# Altium schematic sheet Eth-Crystal.SchDoc
size A
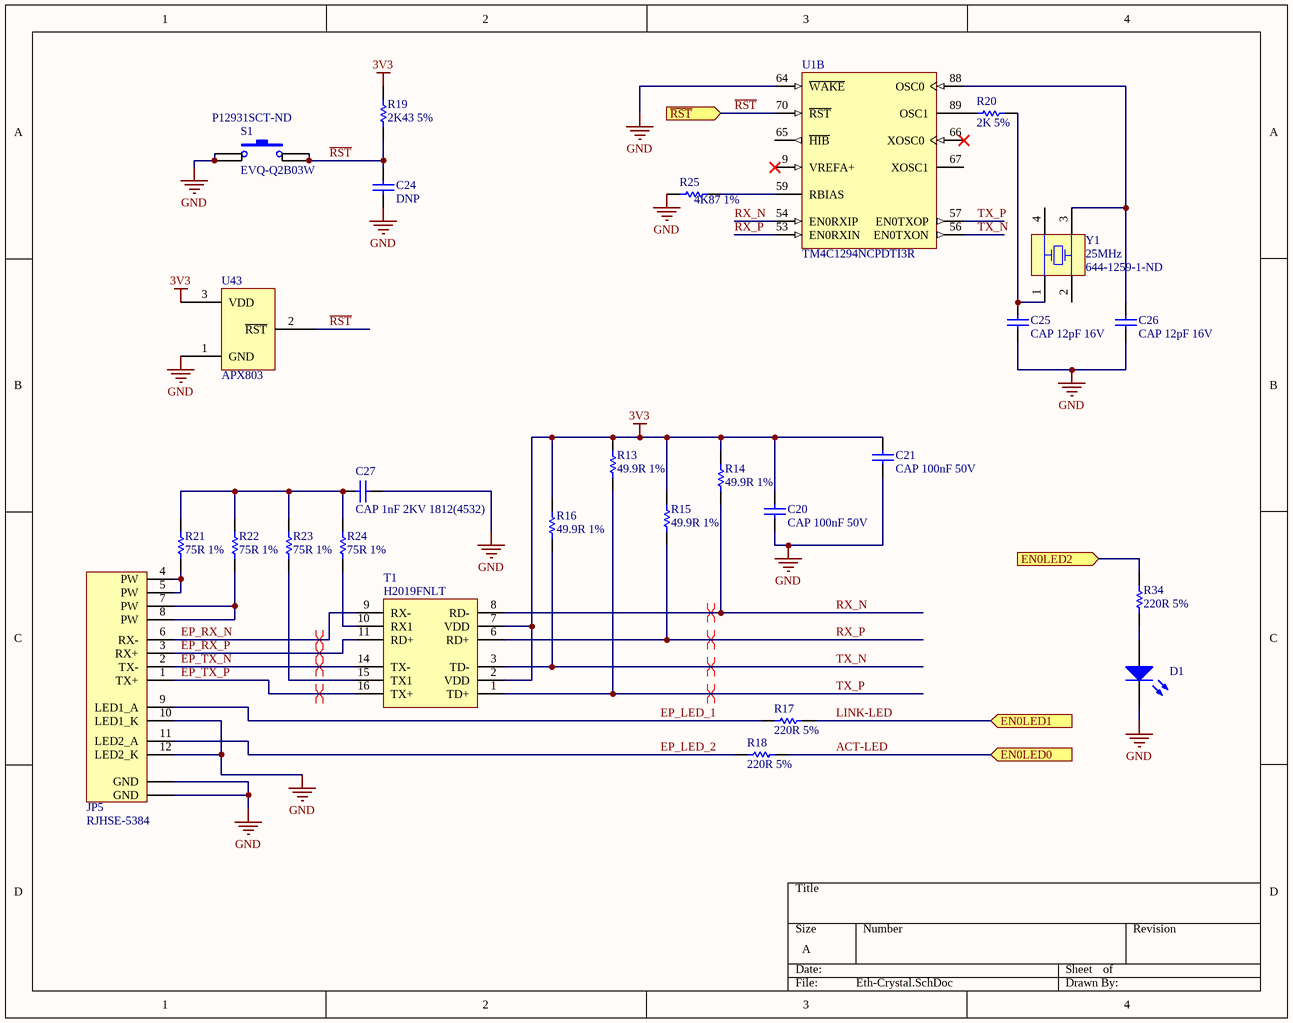
[diagram p0: Eth-Crystal.SchDoc]

## Parts
C20  CAP 100nF 50V  [CAPC0603(1608)100_M]
C21  CAP 100nF 50V  [CAPC0603(1608)100_M]
C24  DNP  [0603]
C25  CAP 12pF 16V  [CAPC0603(1608)100_L]
C26  CAP 12pF 16V  [CAPC0603(1608)100_L]
C27  CAP 1nF 2KV 1812(4532)  [CAPC1812(4532)230_N]
D1  LED  [LED-0603]  (value not drawn)
JP5  RJHSE-5384  [RJHSE-5484]
R13  49.9R 1%  [RESC0603(1608)_M]
R14  49.9R 1%  [RESC0603(1608)_M]
R15  49.9R 1%  [RESC0603(1608)_M]
R16  49.9R 1%  [RESC0603(1608)_M]
R17  220R 5%  [RESC0603(1608)_M]
R18  220R 5%  [RESC0603(1608)_M]
R19  2K43 5%  [RESC0603(1608)_M]
R20  2K 5%  [RESC0603(1608)_N]
R21  75R 1%  [RESC0603(1608)_N]
R22  75R 1%  [RESC0603(1608)_N]
R23  75R 1%  [RESC0603(1608)_N]
R24  75R 1%  [RESC0603(1608)_N]
R25  4K87 1%  [RESC0603(1608)_M]
R34  220R 5%  [RESC0603(1608)_M]
S1  EVQ-Q2B03W  Supplier Part Number 1: P12931SCT-ND  [TACTILE_SWITCH_SMD]
T1  H2019FNLT  [HXXXX]
U1  TM4C1294NCPDTI3R  [TI-PDT128_M]  (part B of 3)
U43  APX803  [SOT-23 - ESD]
Y1  Supplier Part Number 1: 644-1259-1-ND  [Crystal 3.2x2.5]  (hidden comment: 25MHz)

## Ports
EN0LED0 (in), EN0LED1 (in), EN0LED2 (in), ~{RST} (in)

## Nets
3V3: C20.2 C21.2 R13.2 R14.2 R15.2 R16.2 R19.2 T1.2(VDD) T1.7(VDD) U43.3(VDD)
GND: C20.1 C21.1 C24.1 C25.1 C26.1 C27.2 D1.2(K) JP5.10(LED1_K) JP5.12(LED2_K) JP5.GND1(GND) JP5.GND2(GND) R25.1 S1.1 S1.2 U1.64(~{WAKE}) U43.1(GND)
ACT-LED: R18.2 ; port EN0LED0
EN0LED2: R34.2 ; port EN0LED2
EP_LED_1: JP5.9(LED1_A) R17.1
EP_LED_2: JP5.11(LED2_A) R18.1
EP_RX_N: JP5.6(RX-) T1.9(RX-)
EP_RX_P: JP5.3(RX+) T1.11(RD+)
EP_TX_N: JP5.2(TX-) T1.14(TX-)
EP_TX_P: JP5.1(TX+) T1.16(TX+)
LINK-LED: R17.2 ; port EN0LED1
~{RST}: C24.2 R19.1 S1.3 S1.4 U1.70(~{RST}) U43.2(~{RST}) ; port ~{RST}
RX_N: R14.1 T1.8(RD-) U1.54(EN0RXIP)
RX_P: R15.1 T1.6(RD+) U1.53(EN0RXIN)
TX_N: R16.1 T1.3(TD-) U1.56(EN0TXON)
TX_P: R13.1 T1.1(TD+) U1.57(EN0TXOP)
NetC25_2: C25.2 R20.2 Y1.1(OSC1)
NetC26_2: C26.2 U1.88(OSC0) Y1.3(OSC2)
NetC27_1: C27.1 R21.2 R22.2 R23.2 R24.2
NetD1_1: D1.1(A) R34.1
NetJP5_4: JP5.4(PW) JP5.5(PW) R21.1
NetJP5_7: JP5.7(PW) JP5.8(PW) R22.1
NetR20_1: R20.1 U1.89(OSC1)
NetR23_1: R23.1 T1.15(TX1)
NetR24_1: R24.1 T1.10(RX1)
NetR25_2: R25.2 U1.59(RBIAS)

Not connected (* = marked no-connect by the designer): U1 9(VREFA+)* 65(~{HIB}) 66(XOSC0)* 67(XOSC1); Y1 2(OSC2) 4(OSC1)

## Layout directives
differential pair: EP_RX_N, EP_RX_P, EP_TX_N, EP_TX_P, RX_N, RX_P, TX_N, TX_P

## Library data of the parts
C20 C21 = CMP-1035-00010-1: CAP 100nF 50V Â±0.1pF 0603 (1608 Metric) Thickness 1mm SMD; Case-Metric: 1608; Case-EIA: 0603; Tolerance: Â±0.1pF; Technology: SMT; Value: 100nF; Max Thickness: 1 mm; Rated Voltage: 50 V
C24 = Cap_100pF: 100nF; Published: 8-Jun-2000; LatestRevisionDate: 29-May-2009; LatestRevisionNote: IPC-7351 Footprint Added.; PackageReference: C1206; Publisher: Altium Limited; PackageDescription: Chip Capacitor; Value: 100nF; Supplier 1: Digi-Key; Supplier Part Number 1: 399-1096-1-ND; Supplier 2: Mouser; Supplier Part Number 2: 80-C0603C104K3R
C25 C26 = CMP-1035-00602-1: CAP 12pF 16V Â±0.25pF 0603 (1608 Metric) Thickness 1mm SMD; Case-EIA: 0603; Case-Metric: 1608; Technology: SMT; Value: 12pF; Max Thickness: 1 mm; Rated Voltage: 16 V; Tolerance: Â±0.25pF
C27 = CMP-1040-00330-1: CAP 1nF 2KV Â±10% 1812 (4532 Metric) Thickness 2.3mm SMD; Case-EIA: 1812; Case-Metric: 4532; Technology: SMT; Tolerance: Â±10%; Value: 1nF; Max Thickness: 2.3 mm; Rated Voltage: 2K V
D1 = LED: Typical RED, GREEN, YELLOW, AMBER GaAs LED; Published: 8-Jun-2000; LatestRevisionDate: 17-Jul-2002; LatestRevisionNote: Re-released for DXP Platform.; PackageVersion: Feb-2002; PackageReference: 3.2X1.6X1.1; Publisher: Altium Limited; PackageDescription: SM LED; 2 Flat Leads; Supplier 1: Digi-Key; Supplier 2: Mouser; Supplier Part Number 1: 475-1409-1-ND; Supplier Part Number 2: 720-LGQ971-KN-1
JP5 = Ethernet Socket: Ethernet Socket RJ45 With Leds; Supplier 1: Digi-Key; Supplier 2: Mouser; Supplier Part Number 1: RJHSE-5384-ND; Supplier Part Number 2: 523-RJHSE-5484
R13-R16 = CMP-1012-00042-1: 49.9R 0.1W 1% 0603 (1608 Metric)  SMD; Tolerance: 5 %; Value: 49.90 Ohm; Case-Metric: 1608; Case-EIA: 0603; Technology: SMT; Power: 0.1 W
R17 R18 R34 = CMP-1012-00058-1: 220R 0.1W 5% 0603 (1608 Metric)  SMD; Case-EIA: 0603; Case-Metric: 1608; Value: 220.00 Ohm; Technology: SMT; Power: 0.1 W; Tolerance: 5 %
R19 = CMP-1012-00083-1: 2K43 0.1W 5% 0603 (1608 Metric)  SMD; Value: 2430.00 Ohm; Case-Metric: 1608; Case-EIA: 0603; Tolerance: 5 %; Technology: SMT; Power: 0.1 W
R20 = CMP-1012-00081-1: 2K 0.1W 5% 0603 (1608 Metric)  SMD; Case-Metric: 1608; Value: 2000.00 Ohm; Case-EIA: 0603; Tolerance: 5 %; Technology: SMT; Power: 0.1 W
R21-R24 = CMP-1012-00047-1: 75R 0.1W 1% 0603 (1608 Metric)  SMD; Case-EIA: 0603; Value: 75.00 Ohm; Case-Metric: 1608; Tolerance: 5 %; Technology: SMT; Power: 0.1 W
R25 = CMP-1012-00090-1: 4K87 0.1W 1% 0603 (1608 Metric)  SMD; Tolerance: 5 %; Case-Metric: 1608; Value: 4K87.00 Ohm; Case-EIA: 0603; Technology: SMT; Power: 0.1 W
S1 = SW-PB: Switch; Published: 24-Mar-1999; LatestRevisionDate: 17-Jul-2002; LatestRevisionNote: Re-released for DXP Platform.; PackageReference: SPST-2; Publisher: Altium Limited; PackageDescription: Switch; 2 Leads; Supplier 1: Digi-Key
T1 = Magnetics: Power over Ethernet Magnetic Module; Published: 24-Mar-1999; LatestRevisionDate: 17-Jul-2002; LatestRevisionNote: Re-released for DXP Platform.; PackageReference: MODULE5B; Publisher: Altium Limited; Supplier 1: Digi-Key; Supplier 2: Mouser; Supplier Part Number 2: 673-H2019FNLT
U1 = CMP-0945-00007-1: Tiva C Series Microcontroller, 1024 KB Flash, 256 KB SRAM, 12 Bit, 20 Channels, -40 to 85 degC, 128-Pin TQFP (PDT), Green (RoHS & no Sb/Br), Tape and Reel; Manufacturer: Texas Instruments; SRAM: 256 KB; ADC Resolution: 12 Bits; ADC Channels: 20; Flash: 1024 KB; Max Speed: 120 MHz; CPU: ARM Cortex-M4; Packing: Tape and Reel; Mounting Technology: Surface Mount; Eco-Plan: Green (RoHS & no Sb/Br); ComponentLink1URL: http://www.ti.com/; ComponentLink3Description: Package Specification; ComponentLink2Description: Datasheet; PartNumber: TM4C1294NCPDTI3R; DatasheetVersion: 15863.2743; ComponentLink1Description: Manufacturer URL; ComponentLink3URL: http://www.ti.com/lit/ml/mpqf013/mpqf013.pdf; Temperature Range: -40 to 85 degC; ComponentLink2URL: http://www.ti.com/lit/ds/symlink/tm4c1294ncpdt.pdf; PackageVersion: 4087726/A; PackageDescription: 128-Pin Thin Quad Flat Package, Body 14 x 14 mm, Pitch 0.4 mm; PartId: 2
U43 = APX803: IC MPU RESET CIRC 3.08V SOT23R-3; Supplier 1: Digi-Key; Supplier Part Number 1: APX803-31SRG-7DICT-ND
Y1 = Crystal_25MHz: Surface Mount Quartz Crystal; Note: PCB layout complies with manufacturer's recommendation.; Published: 17-Jul-2002; DatasheetDocument: 28-Aug-2001; PackageDocument: 28-Aug-2001; PackageReference: 91SMX; Publisher: Altium Limited; ComponentLink1Description: Manufacturer Link; ComponentLink1URL: http://www.cmac.com/mt/; ComponentLink2Description: Datasheet; ComponentLink2URL: http://www.cmac.com/mt/databook/crystals/smd/90_91_smx.pdf; Value: 25MHz; Supplier 1: Digi-Key